# Altium project Inverter.PrjPcb (part 1 of 2)
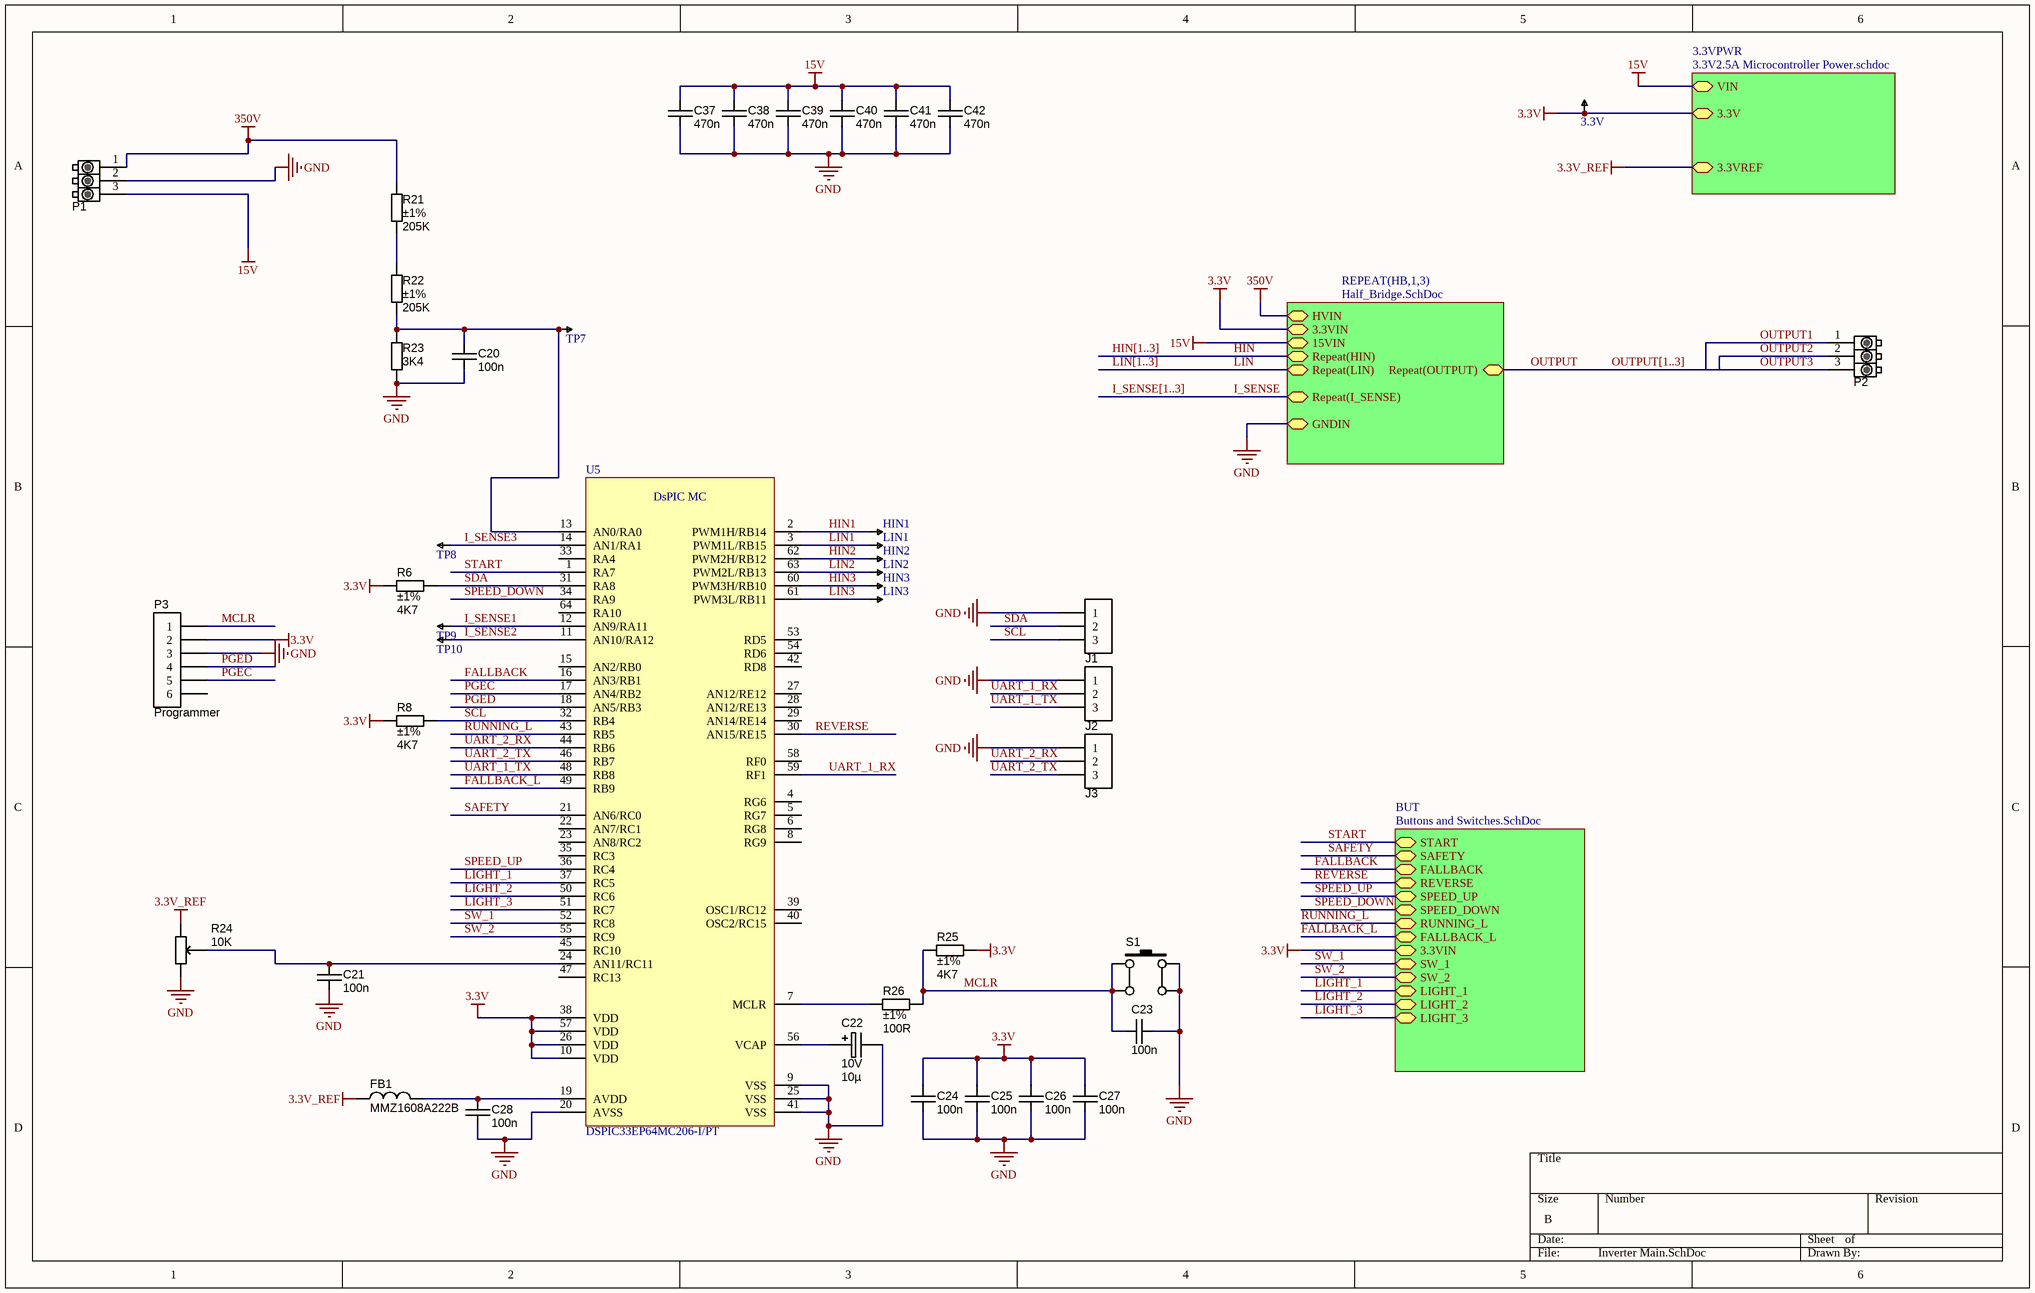
[diagram p0: Inverter Main.SchDoc]
5 sheets, 218 parts. Net scope: hierarchical (ports join the sheet entries above them; power ports are global).
Board file: InverterPCB.PcbDoc
Sheets:
  Inverter Main.SchDoc
    HB1 = Half_Bridge.SchDoc
    HB2 = Half_Bridge.SchDoc
    HB3 = Half_Bridge.SchDoc
    3.3VPWR = 3.3V2.5A Microcontroller Power.schdoc
    BUT = Buttons and Switches.SchDoc
      B1 = Button.SchDoc
      B2 = Button.SchDoc
      B3 = Button.SchDoc
      B4 = Button.SchDoc
      B5 = Button.SchDoc
      B6 = Button.SchDoc
      B7 = Button.SchDoc
      B8 = Button.SchDoc

## Sheet Inverter Main.SchDoc
size B

### Parts
3.3V  TESTPOINT SMD 1206  [1206 Test Point]  (value not drawn)
C20  value 100n  [CAPC1608X90N]  (hidden comment: approved sub OK)
C21  value 100n  [CAPC1608X90N]  (hidden comment: approved sub OK)
C22  Ratings: 10V  [CAPMP2012X150USR]  (hidden comment: 10µ)
C23  value 100n  [CAPC1608X90N]  (hidden comment: approved sub OK)
C24  value 100n  [CAPC1608X90N]  (hidden comment: approved sub OK)
C25  value 100n  [CAPC1608X90N]  (hidden comment: approved sub OK)
C26  value 100n  [CAPC1608X90N]  (hidden comment: approved sub OK)
C27  value 100n  [CAPC1608X90N]  (hidden comment: approved sub OK)
C28  value 100n  [CAPC1608X90N]  (hidden comment: approved sub OK)
C37  value 470n  [CAPC2012X135N]  (hidden comment: approved sub OK)
C38  value 470n  [CAPC2012X135N]  (hidden comment: approved sub OK)
C39  value 470n  [CAPC2012X135N]  (hidden comment: approved sub OK)
C40  value 470n  [CAPC2012X135N]  (hidden comment: approved sub OK)
C41  value 470n  [CAPC2012X135N]  (hidden comment: approved sub OK)
C42  value 470n  [CAPC2012X135N]  (hidden comment: approved sub OK)
FB1  Manufacturer Part Number 1: MMZ1608A222B  [FBC1608X95N]  (hidden comment: 2K2 @ 100 MHz)
HIN1  TESTPOINT SMD 1206  [1206 Test Point]  (value not drawn)
HIN2  TESTPOINT SMD 1206  [1206 Test Point]  (value not drawn)
HIN3  TESTPOINT SMD 1206  [1206 Test Point]  (value not drawn)
J1  JST_PH_B3B  [JST_PH_3_B3B]  (value not drawn)
J2  JST_PH_B3B  [JST_PH_3_B3B]  (value not drawn)
J3  JST_PH_B3B  [JST_PH_3_B3B]  (value not drawn)
LIN1  TESTPOINT SMD 1206  [1206 Test Point]  (value not drawn)
LIN2  TESTPOINT SMD 1206  [1206 Test Point]  (value not drawn)
LIN3  TESTPOINT SMD 1206  [1206 Test Point]  (value not drawn)
P1  3P_TERM BLOCK 796739-3  [TE 796739-3 3 Screw Terminal]  (value not drawn)
P2  3P_TERM BLOCK 796739-3  [TE 796739-3 3 Screw Terminal]  (value not drawn)
P3  Programmer  [HDR1X6]  (no BOM)
R6  value 4K7  Tolerance: ±1%  [RESC1608X55N]  (hidden comment: Thick Film)
R8  value 4K7  Tolerance: ±1%  [RESC1608X55N]  (hidden comment: Thick Film)
R21  value 205K  Tolerance: ±1%  [RESC2012X70N]  (hidden comment: Thick Film)
R22  value 205K  Tolerance: ±1%  [RESC2012X70N]  (hidden comment: Thick Film)
R23  value 3K4  [RESC1608X55N]  (hidden comment: Thick Film)
R24  value 10K  [POT_PDB12_BOURNS]  (hidden comment: RES_POT_10K_THT_PDB12-H4251-103BF)
R25  value 4K7  Tolerance: ±1%  [RESC1608X55N]  (hidden comment: Thick Film)
R26  value 100R  Tolerance: ±1%  [RESC1608X55N]  (hidden comment: Thick Film)
S1  TL3301AF160QJ  [SWITCH_TACT_JLEAD_6mm]  (value not drawn)
TP7  TESTPOINT SMD 1206  [1206 Test Point]  (value not drawn)
TP8  TESTPOINT SMD 1206  [1206 Test Point]  (value not drawn)
TP9  TESTPOINT SMD 1206  [1206 Test Point]  (value not drawn)
TP10  TESTPOINT SMD 1206  [1206 Test Point]  (value not drawn)
U5  uC_dsPIC33EP64MC206  [LQFP50P1200X1200X160-64]  (value not drawn)

### Sub-sheets
3.3VPWR = 3.3V2.5A Microcontroller Power.schdoc: VIN, 3.3V, 3.3VREF
BUT = Buttons and Switches.SchDoc: START, SAFETY, FALLBACK, REVERSE, SPEED_DOWN, SPEED_UP, RUNNING_L, FALLBACK_L, 3.3VIN, SW_1, LIGHT_2, LIGHT_1, SW_2, LIGHT_3
REPEAT(HB,1,3) = Half_Bridge.SchDoc: HVIN, 15VIN, GNDIN, Repeat(LIN), Repeat(HIN), Repeat(OUTPUT), 3.3VIN, Repeat(I_SENSE)

### Nets
3.3V: 3.3V.1 C24.1 C25.1 C26.1 C27.1 P3.2 R6.1 R8.1 R25.2 U5.10(VDD) U5.26(VDD) U5.38(VDD) U5.57(VDD) ; sheet REPEAT(HB,1,3)/3.3VIN, sheet 3.3VPWR/3.3V, sheet BUT/3.3VIN
3.3V_REF: FB1.1 R24.1 ; sheet 3.3VPWR/3.3VREF
15V: C37.1 C38.1 C39.1 C40.1 C41.1 C42.1 P1.3 ; sheet REPEAT(HB,1,3)/15VIN, sheet 3.3VPWR/VIN
350V: P1.1 R21.1 ; sheet REPEAT(HB,1,3)/HVIN
GND: C20.2 C21.2 C22.2 C23.2 C24.2 C25.2 C26.2 C27.2 C28.2 C37.2 C38.2 C39.2 C40.2 C41.2 C42.2 J1.1 J2.1 J3.1 P1.2 P3.3 R23.2 R24.3 S1.3 S1.4 U5.9(VSS) U5.20(AVSS) U5.25(VSS) U5.41(VSS) ; sheet REPEAT(HB,1,3)/GNDIN
FALLBACK: U5.16(AN3/RB1) ; sheet BUT/FALLBACK  [project net BUT2]
FALLBACK_L: U5.49(RB9) ; sheet BUT/FALLBACK_L
HIN: sheet REPEAT(HB,1,3)/Repeat(HIN)
HIN1: HIN1.1 U5.2(PWM1H/RB14)  [project net HIN]
HIN2: HIN2.1 U5.62(PWM2H/RB12)  [project net HIN]
HIN3: HIN3.1 U5.60(PWM3H/RB10)  [project net HIN]
I_SENSE: sheet REPEAT(HB,1,3)/Repeat(I_SENSE)
I_SENSE1: TP9.1 U5.12(AN9/RA11)
I_SENSE2: TP10.1 U5.11(AN10/RA12)
I_SENSE3: TP8.1 U5.14(AN1/RA1)
LIGHT_1: U5.37(RC5) ; sheet BUT/LIGHT_1
LIGHT_2: U5.50(RC6) ; sheet BUT/LIGHT_2
LIGHT_3: U5.51(RC7) ; sheet BUT/LIGHT_3
LIN: sheet REPEAT(HB,1,3)/Repeat(LIN)
LIN1: LIN1.1 U5.3(PWM1L/RB15)  [project net LIN]
LIN2: LIN2.1 U5.63(PWM2L/RB13)  [project net LIN]
LIN3: LIN3.1 U5.61(PWM3L/RB11)  [project net LIN]
MCLR: C23.1 P3.1 R25.1 R26.2 S1.1 S1.2
OUTPUT: sheet REPEAT(HB,1,3)/Repeat(OUTPUT)
OUTPUT1: P2.1
OUTPUT2: P2.2
OUTPUT3: P2.3
PGEC: P3.5 U5.17(AN4/RB2)
PGED: P3.4 U5.18(AN5/RB3)
REVERSE: U5.30(AN15/RE15) ; sheet BUT/REVERSE  [project net BUT4]
RUNNING_L: U5.43(RB5) ; sheet BUT/RUNNING_L
SAFETY: U5.21(AN6/RC0) ; sheet BUT/SAFETY  [project net BUT3]
SCL: J1.3 R8.2 U5.32(RB4)
SDA: J1.2 R6.2 U5.31(RA8)
SPEED_DOWN: U5.34(RA9) ; sheet BUT/SPEED_DOWN  [project net BUT6]
SPEED_UP: U5.36(RC4) ; sheet BUT/SPEED_UP  [project net BUT5]
START: U5.1(RA7) ; sheet BUT/START  [project net BUT1]
SW_1: U5.52(RC8) ; sheet BUT/SW_1  [project net BUT7]
SW_2: U5.55(RC9) ; sheet BUT/SW_2  [project net BUT8]
UART_1_RX: J2.2 U5.59(RF1)
UART_1_TX: J2.3 U5.48(RB8)
UART_2_RX: J3.2 U5.44(RB6)
UART_2_TX: J3.3 U5.46(RB7)
NetC20_1: C20.1 R22.2 R23.1 TP7.1 U5.13(AN0/RA0)
NetC21_1: C21.1 R24.2 U5.24(AN11/RC11)
NetC22_1: C22.1 U5.56(VCAP)
NetC28_1: C28.1 FB1.2 U5.19(AVDD)
NetR21_2: R21.2 R22.1
NetR26_1: R26.1 U5.7(MCLR)

Not connected (* = marked no-connect by the designer): P3 6; U5 4(RG6) 5(RG7) 6(RG8) 8(RG9) 15(AN2/RB0) 22(AN7/RC1) 23(AN8/RC2) 27(AN12/RE12) 28(AN12/RE13) 29(AN14/RE14) 33(RA4) 35(RC3) 39(OSC1/RC12) 40(OSC2/RC15) 42(RD8) 45(RC10) 47(RC13) 53(RD5) 54(RD6) 58(RF0) 64(RA10)

### Buses and harness runs
bus HIN[1..3]
bus I_SENSE[1..3]
bus LIN[1..3]
bus OUTPUT[1..3]

### Notes on the sheet
- (in symbol uC_dsPIC33EP64MC206) DsPIC MC

### Library data of the parts
3.3V HIN1-HIN3 LIN1-LIN3 TP7-TP10 = TESTPOINT SMD 1206: Manufacturer: TE Connectivity AMP Connectors; Manufacturer Part Number: RCS-0C; Material - Insulation: No Insulation; Supplier 1: Digi-Key; Supplier Part Number 1: A106143CT-ND; RoHS: RoHS Compliant; Category: Test and Measurement; Stock 1: 28093; Pricing 1: 1=0.28, 10=0.261, 25=0.224, 50=0.1902, 100=0.1828, 250=0.16412, 500=0.15668, 1000=0.13056 (USD); Packaging: Cut Tape (CT); Part Status: Active; Type: PC Test Point; Mounting Type: Surface Mount; Color: Natural; Size / Dimension: 0.126" L x 0.063" W (3.20mm x 1.60mm); Height: 0.049" (1.25mm); Plating: -; Material - Body: -; ComponentLink1URL: http://www.te.com/commerce/DocumentDelivery/DDEController?Action=srchrtrv&DocNm=1773266&DocType=DS&DocLang=English; ComponentLink1Description: http://www.te.com/commerce/DocumentDelivery/DDEController?Action=srchrtrv&DocNm=1773266&DocType=DS&DocLang=English
C20 C21 C23-C28 = CAPC_100n_0603_X7R_50V_10%: Capacitor SMD Cer 100nF 10% 50V X7R 0603; Manufacturer: Murata Electronics North America; Manufacturer Part Number: GRM188R71H104KA93D; Tolerance: ±10%; Supplier 1: Digi-Key; Supplier Part Number 1: 490-1519-1-ND; RoHS: RoHS Compliant; Category: Capacitors; Stock 1: 21293840; Pricing 1: 1=0.12, 10=0.084, 100=0.0396, 500=0.02778, 1000=0.023 (USD); Packaging: Cut Tape (CT); Part Status: Active; Voltage - Rated: 50V; Temperature Coefficient: X7R; Operating Temperature: -55°C ~ 125°C; Features: -; Ratings: -; Applications: General Purpose; Mounting Type: Surface Mount, MLCC; Package / Case: 0603 (1608 Metric); Size / Dimension: 0.063" L x 0.031" W (1.60mm x 0.80mm); Height - Seated (Max): -; Thickness (Max): 0.035" (0.90mm); Lead Spacing: -; Lead Style: -; ComponentLink1URL: http://www.murata.com/~/media/webrenewal/support/library/catalog/products/capacitor/mlcc/c02e.pdf; ComponentLink1Description: http://www.murata.com/~/media/webrenewal/support/library/catalog/products/capacitor/mlcc/c02e.pdf
C22 = CAPT_10u_0805_10V: Capacitor SMD Tantalum 10uF 20% 10V 0805; Manufacturer 1: AVX Corporation; Manufacturer Part Number 1: TAJP106M010RNJ; SCDType: spec; Package / Case: 0805 (2012 metric); Tolerance: ±20%; Material: Tantalum; Supplier 1: Digi-Key; Supplier Part Number 1: 478-3281-1-ND; Value: 10µ
C37-C42 = CAPC_470n_0805_X7R_50V_10%: 0.47µF ±10% 50V Ceramic Capacitor X7R 0805 (2012 Metric); Manufacturer: Murata Electronics North America; Manufacturer Part Number: GRM21BR71H474KA88K; Supplier 1: Digi-Key; Supplier Part Number 1: 490-8319-1-ND; RoHS: RoHS Compliant; Category: Capacitors; Stock 1: 76560; Pricing 1: 1=0.35, 10=0.244, 100=0.1465, 500=0.10986, 1000=0.09278, 2500=0.08789, 5000=0.08301 (USD); Packaging: Cut Tape (CT); Part Status: Active; Tolerance: ±10%; Voltage - Rated: 50V; Temperature Coefficient: X7R; Operating Temperature: -55°C ~ 125°C; Features: -; Ratings: -; Applications: General Purpose; Mounting Type: Surface Mount, MLCC; Package / Case: 0805 (2012 Metric); Size / Dimension: 0.079" L x 0.049" W (2.00mm x 1.25mm); Height - Seated (Max): -; Thickness (Max): 0.053" (1.35mm); Lead Spacing: -; Lead Style: -; ComponentLink1URL: http://search.murata.co.jp/Ceramy/image/img/A01X/G101/ENG/GRM21BR71H474KA88-01.pdf; ComponentLink1Description: http://search.murata.co.jp/Ceramy/image/img/A01X/G101/ENG/GRM21BR71H474KA88-01.pdf
FB1 = FERRITE_2K2-100MHz_0603: Ferrite bead 2.2K Ohm at 100 MHz 200mA 0603 SMD; Manufacturer 1: TDK Corporation; Ratings: 200 mA; 800 mOhm DC; Impedance @ Frequency: 2200 Ohm @ 100MHz; DC Resistance (DCR): 800 mOhm Max; Filter Type: Differential Mode - Single; SCDType: source; Size / Dimension: 0.063" L x 0.031" W (1.60mm x 0.80mm); Current Rating: 200mA; Package / Case: 0603 (1608 Metric); Height (Max): 0.037" (0.95mm); Mounting Type: Surface Mount; Supplier 1: Digi-Key; Supplier Part Number 1: 445-8671-1-ND; RoHS 1: RoHS Compliant; ComponentLink1URL: http://www.tdk.co.jp/tefe02/e9412_mmz.pdf; ComponentLink1Description: http://www.tdk.co.jp/tefe02/e9412_mmz.pdf; Value: 2K2 @ 100 MHz
J1-J3 = JST_PH_B3B: 2mm Pitch; Supplier 1: Digi-Key; Supplier Part Number 1: 455-1705-ND
P1 P2 = 3P_TERM BLOCK 796739-3: 3 Position Wire to Board Terminal Block Horizontal with Board 0.375" (9.53mm) Through Hole; Manufacturer: TE Connectivity AMP Connectors; Number of Levels: 1; Positions Per Level: 3; Current: 30A; Voltage: 600V; Wire Gauge: 10-30 AWG; Wire Termination: Screw - Rising Cage Clamp; Clamp Material - Plating: Brass - Nickel Plated; Torque - Screw: 0.79 Nm (7.0 Lb-In); Screw Thread: M3; Supplier 1: Digi-Key; Supplier Part Number 1: A98274-ND; RoHS: RoHS Compliant; Category: Connectors, Interconnects; Stock 1: 1080; Pricing 1: 1=5.17, 10=3.942, 25=3.692, 50=3.2816, 100=3.2104, 250=2.96064, 500=2.6753, 1000=2.37209, 2500=2.274 (USD); Packaging: Tray; Part Status: Active; Pitch: 0.375" (9.53mm); Mating Orientation: Horizontal with Board; Mounting Type: Through Hole; Features: Interlocking (Side); Color: Green; Operating Temperature: -; Housing Material: Polyamide (PA66), Nylon 6/6; Contact Material - Plating: -; Screw Material - Plating: Brass - Nickel Plated; ComponentLink1URL: http://www.te.com/commerce/DocumentDelivery/DDEController?Action=srchrtrv&DocNm=796739&DocType=Customer+Drawing&DocLang=English; ComponentLink1Description: http://www.te.com/commerce/DocumentDelivery/DDEController?Action=srchrtrv&DocNm=796739&DocType=Customer+Drawing&DocLang=English; Manufacturer Part Number: 796739-3
P3 = Header6P: Header, 6-pin
R6 R8 R25 = RES_4K7_0603_1%: Resistor SMD chip 4.7K Ohm 0.1W 1% 0603; Manufacturer: Yageo; Manufacturer Part Number: RC0603FR-074K7L; Ratings: 1/10W; SCDType: undef; Package / Case: 0603 (1608 Metric); Supplier 1: Digi-Key; Supplier Part Number 1: 311-4.70KHRCT-ND
R21 R22 = RES_205K_0805_1%: Resistor SMD chip 205k Ohm 0.125W 1% 0805; Manufacturer 1: Vishay/Dale; Manufacturer Part Number 1: CRCW0805205KFKEA; Ratings: 1/8W; SCDType: spec; Package / Case: 0805 (2012 metric); Supplier 1: Digi-Key; Supplier Part Number 1: 541-205KCCT-ND
R23 = RES_3K4_0603_1%: Resistor SMD chip 3.4k Ohm 0.1W 1% 0603; Manufacturer: Panasonic Electronic Components; Manufacturer Part Number: ERJ-3EKF3401V; Power (Watts): 0.1W, 1/10W; Temperature Coefficient: ±100ppm/°C; Tolerance: ±1%; Supplier 1: Digi-Key; Supplier Part Number 1: P3.40KHCT-ND; RoHS: RoHS Compliant; Category: Resistors; Stock 1: 108430; Pricing 1: 1=0.1, 10=0.021, 100=0.0087, 1000=0.00389, 2500=0.00338 (USD); Packaging: Cut Tape (CT); Part Status: Active; Composition: Thick Film; Features: Automotive AEC-Q200; Operating Temperature: -55°C ~ 155°C; Package / Case: 0603 (1608 Metric); Supplier Device Package: 0603; Size / Dimension: 0.063" L x 0.031" W (1.60mm x 0.80mm); Height - Seated (Max): 0.022" (0.55mm); Failure Rate: -; ComponentLink1URL: https://industrial.panasonic.com/cdbs/www-data/pdf/RDA0000/AOA0000C304.pdf; ComponentLink1Description: https://industrial.panasonic.com/cdbs/www-data/pdf/RDA0000/AOA0000C304.pdf
R24 = RES_POT_10K_THT_PDB12-H4251-103BF: 10k Ohm 1 Gang Linear Through Hole Potentiometer None 1 Turn Carbon 0.08W PC Pins, Board Locks; Manufacturer: Bourns Inc.; Tolerance: ±20%; Rotation: 300°; Adjustment Type: Top Adjustment; Actuator Type: Flatted; Actuator Length: 0.984" (25.00mm); Actuator Diameter: 0.236" (6.00mm); Supplier 1: Digi-Key; Supplier Part Number 1: PDB12-H4251-103BF-ND; RoHS: RoHS Compliant; Category: Potentiometers, Variable Resistors; Stock 1: 946; Pricing 1: 1=0.92, 10=0.81, 25=0.7292, 50=0.702, 100=0.675, 250=0.63452, 500=0.54, 1000=0.4995, 5000=0.4104 (USD); Packaging: Bulk; Part Status: Active; Taper: Linear; Resistance (Ohms): 10k; Built in Switch: None; Power (Watts): 0.08W; Temperature Coefficient: -; Resistive Material: Carbon; Termination Style: PC Pins, Board Locks; Bushing Thread: -; Mounting Type: Through Hole; ComponentLink1URL: http://www.bourns.com/docs/Product-Datasheets/PDB12.pdf; ComponentLink1Description: http://www.bourns.com/docs/Product-Datasheets/PDB12.pdf; Manufacturer Part Number: PDB12-H4251-103BF
R26 = RES_100R_0603_1%: Resistor SMD chip 100 Ohm 0.1W 1% 0603; Manufacturer 1: Yageo; Manufacturer Part Number 1: RC0603FR-07100RL; Ratings: 1/10 W; SCDType: spec; Package / Case: 0603 (1608 Metric); Material: Thick Film; Supplier 1: Digi-Key; Supplier Part Number 1: 311-100HRCT-ND; Supplier 2: Digi-Key; Supplier Part Number 2: P100HTR-ND; Manufacturer 2: Panasonic - ECG; Manufacturer Part Number 2: ERJ-3EKF1000V; ComponentLink1URL: http://industrial.panasonic.com/www-cgi/jvcr13pz.cgi?E+PZ+3+AOA0002+ERJ3EKF1000V+7+WW; ComponentLink1Description: http://industrial.panasonic.com/www-cgi/jvcr13pz.cgi?E+PZ+3+AOA0002+ERJ3EKF1000V+7+WW
S1 = TACT_SWITCH 6x6 JLEAD TL3301AF160QJ: Manufacturer: E-Switch; Circuit: SPST-NO; Switch Function: Off-Mom; Contact Rating @ Voltage: 0.05A @ 12VDC; Actuator Type: Standard; Actuator Height off PCB, Vertical: 5.00mm; Actuator Orientation: Top Actuated; Outline: 6.00mm x 6.00mm; Illumination: Non-Illuminated; Operating Force: 160gf; Actuator Material: Polyamide (PA), Nylon; Switch Travel: 0.25mm; Mechanical Life: 100,000 Cycles; Supplier 1: Digi-Key; Supplier Part Number 1: EG4374CT-ND; RoHS: RoHS Compliant; Category: Switches; Stock 1: 12724; Pricing 1: 1=0.43, 10=0.41, 25=0.4024, 50=0.387, 100=0.334, 250=0.3036, 500=0.28842 (USD); Packaging: Cut Tape (CT); Part Status: Active; Mounting Type: Surface Mount; Actuator Length, Right Angle: -; Termination Style: J Lead; Illumination Type, Color: -; Illumination Voltage (Nominal): -; Ingress Protection: -; Features: -; Operating Temperature: -20°C ~ 70°C; ComponentLink1URL: https://www.e-switch.com/system/asset/product_line/data_sheet/158/TL3301.pdf; ComponentLink1Description: https://www.e-switch.com/system/asset/product_line/data_sheet/158/TL3301.pdf; Manufacturer Part Number: TL3301AF160QJ
U5 = uC_dsPIC33EP64MC206: DSPIC33EP64MC206-I/PT; Manufacturer: Microchip Technology; Core Processor: dsPIC; Core Size: 16-Bit; Speed: 70 MIPs; Connectivity: I²C, IrDA, LIN, QEI, SPI, UART/USART; Peripherals: Brown-out Detect/Reset, DMA, Motor Control PWM, POR, PWM, WDT; Program Memory Size: 64KB (22K x 24); Program Memory Type: FLASH; RAM Size: 4K x 16; Voltage - Supply (Vcc/Vdd): 3 V ~ 3.6 V; Data Converters: A/D 16x10b/12b; Oscillator Type: Internal; Supplier 1: Digi-Key; Supplier Part Number 1: DSPIC33EP64MC206-I/PT-ND; RoHS: RoHS Compliant; Category: Integrated Circuits (ICs); Stock 1: 6; Pricing 1: 1=3.03, 25=2.7824, 100=2.52 (USD); Packaging: Tray; Part Status: Active; EEPROM Size: -; Operating Temperature: -40°C ~ 85°C (TA); Package / Case: 64-TQFP; Supplier Device Package: 64-TQFP (10x10); ComponentLink1URL: http://www.microchip.com/mymicrochip/filehandler.aspx?ddocname=en556386; ComponentLink1Description: http://www.microchip.com/mymicrochip/filehandler.aspx?ddocname=en556386; Manufacturer Part Number: DSPIC33EP64MC206-I/PT

## Sheet Half_Bridge.SchDoc
size A
Used 3 times, as channels HB1, HB2, HB3. Parts and nets are listed once, with the designators drawn on the sheet.
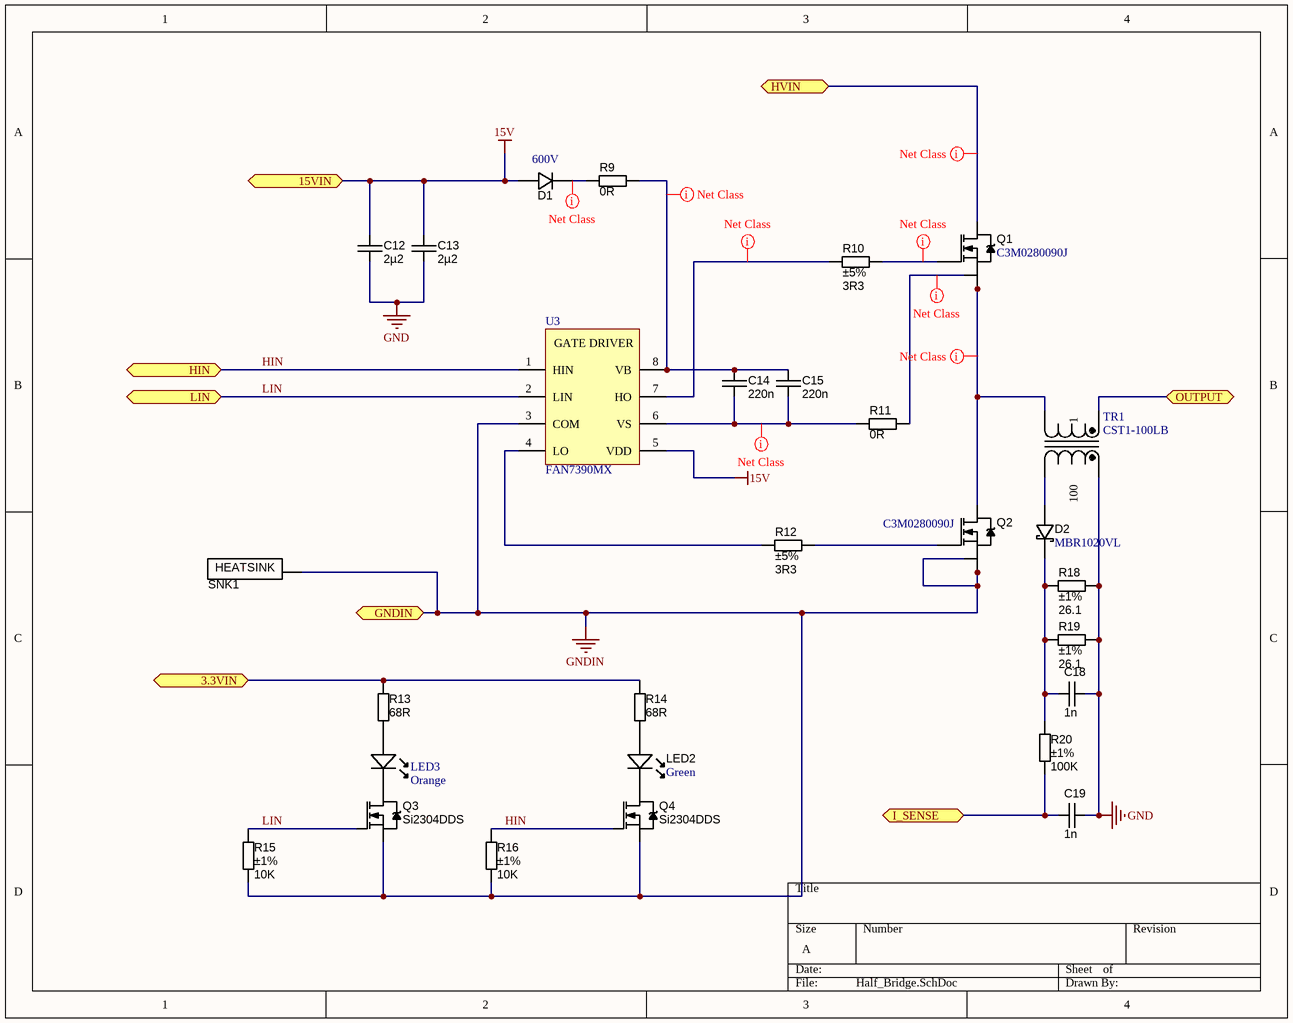
[diagram p1: Half_Bridge.SchDoc]

### Parts
C12  value 2µ2  [CAPC3216X180N]  (hidden comment: approved sub OK)
C13  value 2µ2  [CAPC3216X180N]  (hidden comment: approved sub OK)
C14  value 220n  [CAPC1632X07N]  (hidden comment: approved sub OK)
C15  value 220n  [CAPC1632X07N]  (hidden comment: approved sub OK)
C18  value 1n  [CAPC1608X90N]  (hidden comment: approved sub OK)
C19  value 1n  [CAPC1608X90N]  (hidden comment: approved sub OK)
D1  Voltage - DC Reverse (Vr) (Max): 600V  [DO-214AA]  (hidden comment: ER2J-LTP)
D2  Manufacturer Part Number: MBR1020VL  [SOD123F]  (hidden comment: B320A-13-F)
LED2  Color: Green  [LED-0603-GREEN]  (hidden comment: APT1608CGCK)
LED3  Color: Orange  [LED-0603-AMBER]  (hidden comment: LO L296-Q2S1-24-Z)
Q1  Manufacturer Part Number: C3M0280090J  [DPAK127P1618X457-8N]  (hidden comment: C3M0065090D)
Q2  Manufacturer Part Number: C3M0280090J  [DPAK127P1618X457-8N]  (hidden comment: C3M0065090D)
Q3  Si2304DDS  [SOT23-3]
Q4  Si2304DDS  [SOT23-3]
R9  value 0R  [RESC2012X70N]  (hidden comment: Jumper)
R10  value 3R3  Tolerance: ±5%  [RESC2012X70N]  (hidden comment: Thick Film)
R11  value 0R  [RESC2012X70N]  (hidden comment: Jumper)
R12  value 3R3  Tolerance: ±5%  [RESC2012X70N]  (hidden comment: Thick Film)
R13  value 68R  [RESC1608X55N]  (hidden comment: Thick Film)
R14  value 68R  [RESC1608X55N]  (hidden comment: Thick Film)
R15  value 10K  Tolerance: ±1%  [RESC1005X40N]  (hidden comment: Thick Film)
R16  value 10K  Tolerance: ±1%  [RESC1005X40N]  (hidden comment: Thick Film)
R18  value 26.1  Tolerance: ±1%  [RESC2012X70N]  (hidden comment: Thick Film)
R19  value 26.1  Tolerance: ±1%  [RESC2012X70N]  (hidden comment: Thick Film)
R20  value 100K  Tolerance: ±1%  [RESC1608X55N]  (hidden comment: Thick Film)
SNK1  ATS-CPX025025010-137-C2-R0  [HeatSink ATS-CPX025025010-165-C2-R0]  (value not drawn)
TR1  CST1-100LB  [CST1]
U3  FAN7390MX  [SOIC127P600X175-8AN]

### Ports
3.3VIN, 15VIN, GNDIN, HIN, HVIN, I_SENSE, LIN, OUTPUT

### Nets
15V: C12.1 C13.1 D1.A U3.5(VDD) ; port 15VIN
GND: C12.2 C13.2 C18.2 C19.2 R18.2 R19.2 TR1.6
GNDIN: Q2.2 Q2.3(S) Q2.4 Q2.5 Q2.6 Q2.7 Q3.2(S) Q4.2(S) R15.2 R16.2 SNK1.1(GND) U3.3(COM) ; port GNDIN
3.3VIN: R13.1 R14.1 ; port 3.3VIN
HIN: Q4.1(G) R16.1 U3.1(HIN) ; port HIN
HVIN: Q1.8(D) ; port HVIN
I_SENSE: C19.1 R20.1 ; port I_SENSE
LIN: Q3.1(G) R15.1 U3.2(LIN) ; port LIN
OUTPUT: TR1.8 ; port OUTPUT
NetC14_1: C14.1 C15.1 R9.2 U3.8(VB)
NetC14_2: C14.2 C15.2 R11.1 U3.6(VS)
NetC18_1: C18.1 D2.K R18.1 R19.1 R20.2
NetD1_K: D1.K R9.1
NetD2_A: D2.A TR1.4
NetLED2_A: LED2.A R14.2
NetLED2_K: LED2.K Q4.3(D)
NetLED3_A: LED3.A R13.2
NetLED3_K: LED3.K Q3.3(D)
NetQ1_1: Q1.1(G) R10.2
NetQ1_2: Q1.2 R11.2
NetQ1_3: Q1.3(S) Q1.4 Q1.5 Q1.6 Q1.7 Q2.8(D) TR1.7
NetQ2_1: Q2.1(G) R12.2
NetR10_1: R10.1 U3.7(HO)
NetR12_1: R12.1 U3.4(LO)

### Channels
HB1: designators C12=C12_HB1 C13=C13_HB1 C14=C14_HB1 C15=C15HB1 C18=C18HB1 C19=C19HB1 D1=D1HB1 D2=D2HB1 LED2=LED2_HB1 LED3=LED3_HB1 Q1=Q1_HB1 Q2=Q2_HB1 Q3=Q3_HB1 Q4=Q4_HB1 R9=R9_HB1 R10=R10_HB1 R11=R11_HB1 R12=R12_HB1 R13=R13_HB1 R14=R14_HB1 R15=R15_HB1 R16=R16_HB1 R18=R18HB1 R19=R19HB1 R20=R20HB1 SNK1=SNK1HB1 TR1=TR1HB1 U3=U3_HB1; ports 3.3VIN=3.3V 15VIN=15V GNDIN=GND HIN=HIN HVIN=350V I_SENSE=I_SENSE1 LIN=LIN OUTPUT=OUTPUT1
HB2: designators C12=C12_HB2 C13=C13_HB2 C14=C14_HB2 C15=C15HB2 C18=C18HB2 C19=C19HB2 D1=D1HB2 D2=D2HB2 LED2=LED2_HB2 LED3=LED3_HB2 Q1=Q1_HB2 Q2=Q2_HB2 Q3=Q3_HB2 Q4=Q4_HB2 R9=R9_HB2 R10=R10_HB2 R11=R11_HB2 R12=R12_HB2 R13=R13_HB2 R14=R14_HB2 R15=R15_HB2 R16=R16_HB2 R18=R18HB2 R19=R19HB2 R20=R20HB2 SNK1=SNK1HB2 TR1=TR1HB2 U3=U3_HB2; ports 3.3VIN=3.3V 15VIN=15V GNDIN=GND HIN=HIN HVIN=350V I_SENSE=I_SENSE2 LIN=LIN OUTPUT=OUTPUT2
HB3: designators C12=C12_HB3 C13=C13_HB3 C14=C14_HB3 C15=C15HB3 C18=C18HB3 C19=C19HB3 D1=D1HB3 D2=D2HB3 LED2=LED2_HB3 LED3=LED3_HB3 Q1=Q1_HB3 Q2=Q2_HB3 Q3=Q3_HB3 Q4=Q4_HB3 R9=R9_HB3 R10=R10_HB3 R11=R11_HB3 R12=R12_HB3 R13=R13_HB3 R14=R14_HB3 R15=R15_HB3 R16=R16_HB3 R18=R18HB3 R19=R19HB3 R20=R20HB3 SNK1=SNK1HB3 TR1=TR1HB3 U3=U3_HB3; ports 3.3VIN=3.3V 15VIN=15V GNDIN=GND HIN=HIN HVIN=350V I_SENSE=I_SENSE3 LIN=LIN OUTPUT=OUTPUT3

### Layout directives
net class BOOT_S: NetC14_HB1_1, NetC14_HB1_2, NetD1HB1_K, NetQ1_HB1_1, NetQ1_HB1_2, NetQ1_HB1_3, NetR10_HB1_1
net class 350V: 350V

### Notes on the sheet
- (in symbol CURRENT_100:1_20A_CST1-100LB) 1; 100
- (in symbol GATE_DRV_2_600V_4.5A) GATE DRIVER
- (in symbol HEATSINK_25mmx25mm_ATS-CPX025025010-137-C2-R0) HEATSINK

### Library data of the parts
C12 C13 = CAPC_2u2_50V_1206: Capacitor SMD Cer 2.2uF 10% 50V X7R 1206; SCDType: undef; Tolerance: ±10%; Supplier 1: Digi-Key; Supplier Part Number 1: 1276-1291-1-ND
C14 C15 = CAPC_220n_0612_X7R_25V_10%: Capacitor SMD Cer 220nF 10% 25V X7R 0612; Manufacturer: AVX Corporation; Manufacturer Part Number: 06123C224KAT2A; Tolerance: ±20%; Voltage - Rated: 25V; Supplier 1: Digi-Key; Supplier Part Number 1: 478-2902-1-ND; RoHS: RoHS Compliant; Category: Capacitors; Stock 1: 3680; Pricing 1: 1=1.73, 10=1.366, 100=1.0247, 500=0.77418, 1000=0.6831 (USD); Packaging: Cut Tape (CT); Part Status: Active; Temperature Coefficient: X7R; Operating Temperature: -55°C ~ 125°C; Features: Low ESL (Reverse Geometry); Ratings: -; Applications: Bypass, Decoupling; Mounting Type: Surface Mount, MLCC; Package / Case: 0612 (1632 Metric); Size / Dimension: 0.063" L x 0.126" W (1.60mm x 3.20mm); Height - Seated (Max): -; Thickness (Max): 0.050" (1.27mm); Lead Spacing: -; Lead Style: -; ComponentLink1URL: http://datasheets.avx.com/licc.pdf; ComponentLink1Description: http://datasheets.avx.com/licc.pdf
C18 C19 = CAPC_1n_0603_X7R_100V_10%: Capacitor SMD Cer 1nF 10% 100V X7R 0603; Manufacturer 1: Murata Electronics North America; Manufacturer Part Number 1: GCM188R72A102KA37D; Ratings: 100V; X7R; Material: ceramic; SCDType: spec; Package / Case: 0603 (1608 metric); Tolerance: ±10%; Supplier 1: Digi-Key; Supplier Part Number 1: 490-4780-1-ND; Operating Temperature: -55°C ~ 125°C; Size / Dimension: 0.063" L x 0.031" W (1.60mm x 0.80mm); Thickness (Max): 0.035" (0.90mm); ComponentLink1URL: http://search.murata.co.jp/Ceramy/image/img/PDF/ENG/GCM188R72A102KA37.pdf; ComponentLink1Description: http://search.murata.co.jp/Ceramy/image/img/PDF/ENG/GCM188R72A102KA37.pdf
D1 = DIODE_600V_2A_ER2J-LTP: Diode Standard 600V 2A Surface Mount DO-214AA (SMB); Manufacturer: Micro Commercial Co; Voltage - Forward (Vf) (Max) @ If: 1.7V @ 2A; Speed: Fast Recovery =< 500ns, > 200mA (Io); Current - Reverse Leakage @ Vr: 5µA @ 600V; Capacitance @ Vr, F: 15pF @ 4V, 1MHz; Supplier 1: Digi-Key; Supplier Part Number 1: ER2J-LTPMSCT-ND; RoHS: RoHS Compliant; Category: Discrete Semiconductor Products; Stock 1: 527; Pricing 1: 1=0.51, 10=0.362, 25=0.2976, 100=0.2379, 250=0.17304, 500=0.1406, 1000=0.10815 (USD); Packaging: Cut Tape (CT); Part Status: Active; Diode Type: Standard; Current - Average Rectified (Io): 2A; Mounting Type: Surface Mount; Package / Case: DO-214AA, SMB; Supplier Device Package: DO-214AA (SMB); Operating Temperature - Junction: -65°C ~ 175°C; ComponentLink1URL: http://www.mccsemi.com/up_pdf/ER2A-L~ER2J-L(DO-214AA).pdf; ComponentLink1Description: http://www.mccsemi.com/up_pdf/ER2A-L~ER2J-L(DO-214AA).pdf; Manufacturer Part Number: ER2J-LTP
D2 = DIODE_SCHOTTKY_20V_1A_MBR1020VL: Diode Schottky 20V 1A Surface Mount SOD-123F; Manufacturer: Fairchild/ON Semiconductor; Voltage - Forward (Vf) (Max) @ If: 340mV @ 1A; Speed: Fast Recovery =< 500ns, > 200mA (Io); Current - Reverse Leakage @ Vr: 600µA @ 20V; Supplier 1: Digi-Key; Supplier Part Number 1: MBR1020VLCT-ND; RoHS: RoHS Compliant; Category: Discrete Semiconductor Products; Stock 1: 10857; Pricing 1: 1=0.39, 10=0.293, 100=0.1661, 500=0.11, 1000=0.08433 (USD); Packaging: Cut Tape (CT); Part Status: Active; Diode Type: Schottky; Current - Average Rectified (Io): 1A; Capacitance @ Vr, F: -; Mounting Type: Surface Mount; Package / Case: SOD-123F; Supplier Device Package: SOD-123F; Operating Temperature - Junction: -55°C ~ 125°C; ComponentLink1URL: https://www.fairchildsemi.com/datasheets/MB/MBR1020VL.pdf; ComponentLink1Description: https://www.fairchildsemi.com/datasheets/MB/MBR1020VL.pdf
LED2 = LED_SMD_Green_0603_50mcd: Green 570nm LED Indication - Discrete 2.1V 0603 (1608 Metric); Manufacturer: Kingbright; Lens Color: Colorless; Lens Transparency: Clear; Millicandela Rating: 50mcd; Lens Style/Size: Rectangle with Flat Top, 1.20mm x 0.80mm; Current - Test: 20mA; Viewing Angle: 120°; Wavelength - Peak: 574nm; Supplier 1: Digi-Key; Supplier Part Number 1: 754-1116-1-ND; Manufacturer Part Number: APT1608CGCK; Packaging: Cut Tape (CT); Part Status: Active; Voltage - Forward (Vf) (Typ): 2.1V; Mounting Type: Surface Mount; Wavelength - Dominant: 570nm; Features: -; Package / Case: 0603 (1608 Metric); Supplier Device Package: Chip LED; Size / Dimension: 1.60mm L x 0.80mm W; Height (Max): 0.75mm; ComponentLink1URL: http://www.kingbrightusa.com/images/catalog/SPEC/APT1608CGCK.pdf; ComponentLink1Description: http://www.kingbrightusa.com/images/catalog/SPEC/APT1608CGCK.pdf; RoHS: RoHS Compliant; Category: Optoelectronics; Stock 1: 896844; Pricing 1: 1=0.47, 10=0.337, 25=0.258, 100=0.1683, 250=0.12344, 500=0.10472, 1000=0.08602 (USD)
LED3 = LED_0603_Orange: LED ORANGE DIFFUSED 0603 SMD; Manufacturer: OSRAM Opto Semiconductors Inc.; Lens Color: White; Millicandela Rating: 157mcd; Lens Style/Size: Rectangle with Flat Top, 1.30mm x 0.80mm; Voltage - Forward (Vf) (Typ): 2V; Current - Test: 20mA; Viewing Angle: 160°; Wavelength - Dominant: 605nm; Supplier 1: Digi-Key; Manufacturer Part Number: LO L296-Q2S1-24-Z; Packaging: Cut Tape (CT); Part Status: Active; Lens Transparency: Diffused; Mounting Type: Surface Mount; Wavelength - Peak: -; Features: -; Package / Case: 0603 (1608 Metric); Size / Dimension: 1.70mm L x 0.80mm W; Height (Max): 0.65mm; ComponentLink1URL: http://www.osram-os.com/Graphics/XPic9/00077122_0.pdf; ComponentLink1Description: http://www.osram-os.com/Graphics/XPic9/00077122_0.pdf; Supplier Part Number 1: 475-2739-1-ND; RoHS: RoHS Compliant; Category: Optoelectronics; Stock 1: 4435; Pricing 1: 1=0.34, 10=0.245, 25=0.2004, 100=0.1603, 250=0.13524, 500=0.11522, 1000=0.09017, 2500=0.08349 (USD)
Q1 Q2 = SiC_N-CHAN_900V_11A_C3M0280090J: N-Channel 36A (Tc) 125W (Tc) Through Hole TO-247-3; Manufacturer: Cree/Wolfspeed; Current - Continuous Drain (Id) @ 25°C: 11A (Tc); Drive Voltage (Max Rds On,  Min Rds On): 15V; Vgs(th) (Max) @ Id: 3.5V @ 1.2mA; Gate Charge (Qg) (Max) @ Vgs: 9.5nC @ 15V; Input Capacitance (Ciss) (Max) @ Vds: 150pF @ 600V; Vgs (Max): +18V, -8V; Power Dissipation (Max): 50W (Tc); Rds On (Max) @ Id, Vgs: 360 mOhm @ 7.5A, 15V; Supplier 1: Digi-Key; Supplier Part Number 1: C3M0280090J-ND; RoHS: RoHS Compliant; Category: Discrete Semiconductor Products; Stock 1: 713; Pricing 1: 1=3.84 (USD); Packaging: Tube; Part Status: Active; FET Type: N-Channel; Technology: SiCFET (Silicon Carbide); FET Feature: -; Operating Temperature: -55°C ~ 150°C (TJ); Mounting Type: Surface Mount; Supplier Device Package: D2PAK-7; Package / Case: TO-263-8, D²Pak (7 Leads + Tab), TO-263CA; ComponentLink1URL: http://www.wolfspeed.com/media/downloads/835/C3M0280090J.pdf; ComponentLink1Description: http://www.wolfspeed.com/media/downloads/835/C3M0280090J.pdf
Q3 Q4 = MOSFET_Si2304DDS: MOSFET SMD N-CH 30V 3.6A 1.7W SOT23-3; Material: Metal Oxide; SCDType: source; Ratings: 30V; 3.6A; Package / Case: SOT23-3; Supplier 1: Digi-Key; Supplier Part Number 1: SI2304DDS-T1-GE3CT-ND
R9 R11 = RES_0R_0805: Resistor SMD chip 0.0 Ohm 0.125W 0805; Manufacturer 1: Samsung Electro-Mechanics America, Inc; Manufacturer Part Number 1: RC2012J000CS; Ratings: 1/8W; SCDType: spec; Tolerance: N/A; Package / Case: 0805 (2012 metric); Supplier 1: Digi-Key; Supplier Part Number 1: 1276-5466-6-ND; RoHS 1: RoHS Compliant; ComponentLink1URL: http://www.samsungsem.com/servlet/FileDownload?filename=productcatalog/pdf/Chip_Resistor.pdf; ComponentLink1Description: http://www.samsungsem.com/servlet/FileDownload?filename=productcatalog/pdf/Chip_Resistor.pdf; Supplier 2: Digi-Key; Supplier Part Number 2: RMCF0805ZT0R00DKR-ND; Manufacturer 2: Stackpole Electronics Inc; Manufacturer Part Number 2: RMCF0805ZT0R00; RoHS 2: RoHS Compliant; ComponentLink2URL: http://www.seielect.com/Catalog/SEI-RMCF_RMCP.pdf; ComponentLink2Description: http://www.seielect.com/Catalog/SEI-RMCF_RMCP.pdf; Supplier 3: Digi-Key; Supplier Part Number 3: 311-0.0ARDKR-ND; Manufacturer 3: Yageo; Manufacturer Part Number 3: RC0805JR-070RL; RoHS 3: RoHS Compliant; ComponentLink3URL: http://media.digikey.com/pdf/Data%20Sheets/Yageo%20PDFs/RC0805%20Pb%20Free.pdf; ComponentLink3Description: http://media.digikey.com/pdf/Data%20Sheets/Yageo%20PDFs/RC0805%20Pb%20Free.pdf; Supplier 4: Digi-Key; Supplier Part Number 4: P0.0ADKR-ND; Manufacturer 4: Panasonic Electronic Components; Manufacturer Part Number 4: ERJ-6GEY0R00V; RoHS 4: RoHS Compliant; ComponentLink4URL: http://industrial.panasonic.com/www-cgi/jvcr13pz.cgi?E+PZ+3+AOA0001+ERJ6GEY0R00V+7+WW; ComponentLink4Description: http://industrial.panasonic.com/www-cgi/jvcr13pz.cgi?E+PZ+3+AOA0001+ERJ6GEY0R00V+7+WW; Supplier 5: Digi-Key; Supplier Part Number 5: RHM0.0CPDKR-ND; Manufacturer 5: Rohm Semiconductor; Manufacturer Part Number 5: MCR10ERTJ000; RoHS 5: RoHS Compliant; ComponentLink5URL: http://rohmfs.rohm.com/en/products/databook/datasheet/passive/resistor/chip_resistor/mcr_g.pdf; ComponentLink5Description: http://rohmfs.rohm.com/en/products/databook/datasheet/passive/resistor/chip_resistor/mcr_g.pdf
R10 R12 = RES_3R3_0805_5%: Resistor SMD chip 3.3 Ohm 0.5W 0805; Manufacturer: Panasonic Electronic Components; Manufacturer Part Number: ERJ-6DQJ3R0V; Power (Watts): 0.5W, 1/2W; Temperature Coefficient: ±100ppm/°C; Supplier 1: Digi-Key; Supplier Part Number 1: P19231CT-ND; RoHS: RoHS Compliant; Category: Resistors; Stock 1: 3694; Pricing 1: 1=0.23, 10=0.198, 25=0.1444, 50=0.1046, 100=0.0776, 250=0.05952, 500=0.0469, 1000=0.03247 (USD); Packaging: Cut Tape (CT); Part Status: Active; Composition: Thick Film; Features: Automotive AEC-Q200, Current Sense; Operating Temperature: -55°C ~ 155°C; Package / Case: 0805 (2012 Metric); Supplier Device Package: 0805; Size / Dimension: 0.079" L x 0.049" W (2.00mm x 1.25mm); Height - Seated (Max): 0.028" (0.70mm); Failure Rate: -; ComponentLink1URL: https://industrial.panasonic.com/cdbs/www-data/pdf/RDN0000/AOA0000C313.pdf; ComponentLink1Description: https://industrial.panasonic.com/cdbs/www-data/pdf/RDN0000/AOA0000C313.pdf
R13 R14 = RES_68R_0603_5%: Resistor SMD chip 68 Ohm 0.1W 5% 0603; Manufacturer 1: Yageo; Manufacturer Part Number 1: RC0603JR-0768RL; Ratings: 1/10 W; SCDType: spec; Package / Case: 0603 (1608 metric); Tolerance: ±5%; Material: Thick Film; Supplier 1: Digi-Key; Supplier Part Number 1: 311-68GRCT-ND
R15 R16 = RES_10K_0402_1%: Resistor SMD chip 10k Ohm 0.063W 1% 0402; Manufacturer 1: Vishay Dale; Manufacturer Part Number 1: CRCW040210K0FKED; Ratings: 1/16 W; SCDType: spec; Package / Case: 0402 (1005 Metric); Manufacturer 2: Yageo; Manufacturer Part Number 2: RC0402FR-0710KL; Supplier 1: Digi-Key; Supplier Part Number 1: 541-10.0KLCT-ND; ComponentLink1URL: http://www.vishay.com/doc?20035; ComponentLink1Description: http://www.vishay.com/doc?20035; Supplier 2: Digi-Key; Supplier Part Number 2: 311-10.0KLRCT-ND; ComponentLink2URL: http://www.yageo.com/documents/recent/PYu-RC0402_51_RoHS_L_6.pdf; ComponentLink2Description: http://www.yageo.com/documents/recent/PYu-RC0402_51_RoHS_L_6.pdf
R18 R19 = RES_26R1_0805_1%: Resistor SMD chip 26.1k Ohm 0.125W 1% 0805; Manufacturer: Panasonic Electronic Components; Manufacturer Part Number: ERJ-6ENF26R1V; Power (Watts): 0.125W, 1/8W; Temperature Coefficient: ±100ppm/°C; Supplier 1: Digi-Key; Supplier Part Number 1: P26.1CCT-ND; RoHS: RoHS Compliant; Category: Resistors; Stock 1: 23109; Pricing 1: 1=0.1, 10=0.041, 100=0.0167, 1000=0.00749, 2500=0.0065 (USD); Packaging: Cut Tape (CT); Part Status: Active; Composition: Thick Film; Features: Automotive AEC-Q200; Operating Temperature: -55°C ~ 155°C; Package / Case: 0805 (2012 Metric); Supplier Device Package: 0805; Size / Dimension: 0.079" L x 0.049" W (2.00mm x 1.25mm); Height - Seated (Max): 0.028" (0.70mm); Failure Rate: -; ComponentLink1URL: https://industrial.panasonic.com/cdbs/www-data/pdf/RDA0000/AOA0000C304.pdf; ComponentLink1Description: https://industrial.panasonic.com/cdbs/www-data/pdf/RDA0000/AOA0000C304.pdf
R20 = RES_100K_0603_1%: Resistor SMD chip 100k Ohm 0.1W 1% 0603; Manufacturer 1: Vishay/Dale; Manufacturer Part Number 1: CRCW0603100KFKEA; Ratings: 1/10W; SCDType: spec; Package / Case: 0603 (2012 metric); Supplier 1: Digi-Key; Supplier Part Number 1: 541-100KHCT-ND
SNK1 = HEATSINK_25mmx25mm_ATS-CPX025025010-137-C2-R0: Heat Sink Assorted (BGA, LGA, CPU, ASIC...) Aluminum Top Mount; Manufacturer: Advanced Thermal Solutions Inc.; Attachment Method: Push Pin; Shape: Square, Fins; Thermal Resistance @ Forced Air Flow: 18.36°C/W @ 100 LFM; Material Finish: Blue Anodized; Supplier 1: Digi-Key; Supplier Part Number 1: ATS1514-ND; RoHS: RoHS Compliant; Category: Fans, Thermal Management; Stock 1: 1318; Pricing 1: 1=2.86, 10=2.784, 25=2.7088, 50=2.5584, 100=2.4078, 250=2.25736, 500=2.1821, 1000=1.95637, 5000=1.91875 (USD); Part Status: Active; Type: Top Mount; Package Cooled: Assorted (BGA, LGA, CPU, ASIC...); Length: 0.984" (25.00mm); Width: 0.984" (25.00mm); Diameter: -; Height Off Base (Height of Fin): 0.394" (10.00mm); Power Dissipation @ Temperature Rise: -; Thermal Resistance @ Natural: -; Material: Aluminum; ComponentLink1URL: https://www.qats.com/pushPIN/DataSheet/ATS-CPX025025010-137-C2-R0; ComponentLink1Description: https://www.qats.com/pushPIN/DataSheet/ATS-CPX025025010-137-C2-R0; Manufacturer Part Number: ATS-CPX025025010-137-C2-R0
TR1 = CURRENT_100:1_20A_CST1-100LB: Sufrace Mount Current Transformer 100:1 Ratio 20A; Frequency: 9kHz-1000kHz; Ratio: 100:1; Current (Max): 20A; Manufacturer Part Number: CST1-100LB
U3 = GATE_DRV_2_600V_4.5A: Half-Bridge Gate Driver IC Non-Inverting 8-SOP; Manufacturer: Fairchild/ON Semiconductor; Channel Type: Independent; Gate Type: IGBT, N-Channel MOSFET; Voltage - Supply: 10 V ~ 22 V; Logic Voltage - VIL, VIH: 1.2V, 2.5V; Current - Peak Output (Source, Sink): 4.5A, 4.5A; Rise / Fall Time (Typ): 25ns, 20ns; Supplier 1: Digi-Key; Supplier Part Number 1: FAN7390MXCT-ND; RoHS: RoHS Compliant; Category: Integrated Circuits (ICs); Stock 1: 5064; Pricing 1: 1=1.79, 10=1.61, 100=1.2944, 500=1.06348, 1000=0.88117 (USD); Packaging: Cut Tape (CT); Part Status: Active; Driven Configuration: Half-Bridge; Input Type: Non-Inverting; Operating Temperature: -40°C ~ 150°C (TJ); Mounting Type: Surface Mount; Package / Case: 8-SOIC (0.154", 3.90mm Width); Supplier Device Package: 8-SOP; ComponentLink1URL: https://www.fairchildsemi.com/datasheets/FA/FAN7390.pdf; ComponentLink1Description: https://www.fairchildsemi.com/datasheets/FA/FAN7390.pdf; Manufacturer Part Number: FAN7390MX

## Sheet 3.3V2.5A Microcontroller Power.schdoc
size 363 x 144 mm; SheetNumber: 1; SheetTotal: 1
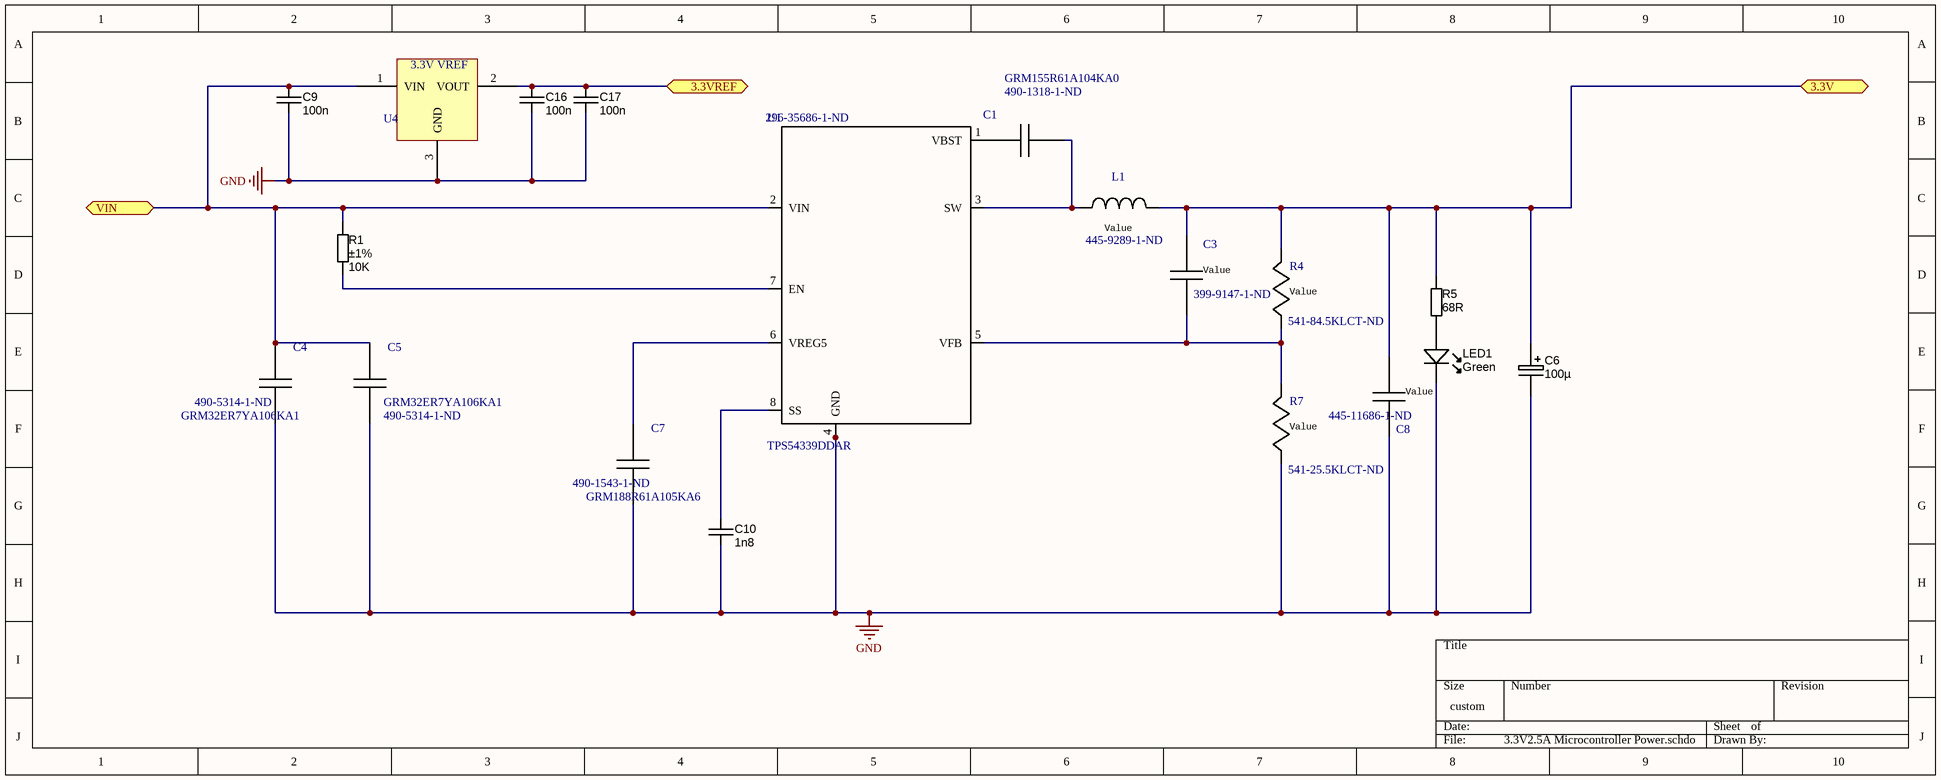
[diagram p2: 3.3V2.5A Microcontroller Power.schdoc]

### Parts
C1  GRM155R61A104KA0  Supplier Part Number 1: 490-1318-1-ND  [0402]
C3  Supplier Part Number 1: 399-9147-1-ND  [0805]  (hidden comment: C0805C100M4GACTU)
C4  GRM32ER7YA106KA1  Supplier Part Number 1: 490-5314-1-ND  [1210_280]
C5  GRM32ER7YA106KA1  Supplier Part Number 1: 490-5314-1-ND  [1210_280]
C6  value 100µ  [CAPMP7343X310N]  (hidden comment: T520D107M010ATE080)
C7  GRM188R61A105KA6  Supplier Part Number 1: 490-1543-1-ND  [0603]
C8  Supplier Part Number 1: 445-11686-1-ND  [1206]  (hidden comment: C3216JB1A476M)
C9  value 100n  [CAPC1608X90N]  (hidden comment: approved sub OK)
C10  value 1n8  [CAPC2012X135N]  (hidden comment: approved sub OK)
C16  value 100n  [CAPC1608X90N]  (hidden comment: approved sub OK)
C17  value 100n  [CAPC1608X90N]  (hidden comment: approved sub OK)
L1  Supplier Part Number 1: 445-9289-1-ND  [CLF7045]  (hidden comment: CLF7045T-3R3N)
LED1  Green  [LED-0603-GREEN]
R1  value 10K  Tolerance: ±1%  [RESC1005X40N]  (hidden comment: Thick Film)
R4  Supplier Part Number 1: 541-84.5KLCT-ND  [0402]  (hidden comment: CRCW040284K5FKED)
R5  value 68R  [RESC1005X40N]  (hidden comment: Thick Film)
R7  Supplier Part Number 1: 541-25.5KLCT-ND  [0402]  (hidden comment: CRCW040225K5FKED)
U1  TPS54339DDAR  Supplier Part Number 1: 296-35686-1-ND  [DDA0008E]
U4  NCP51460SN33T1G  [SOT23-3]  (value not drawn)

### Ports
3.3V, 3.3VREF, VIN

### Nets
3.3V: C3.1 C6.1 C8.1 L1.1 R4.1 R5.1 ; port 3.3V
3.3V_REF: C16.1 C17.1 U4.2(VOUT) ; port 3.3VREF
15V: C4.1 C5.1 C9.1 R1.1 U1.2(VIN) U4.1(VIN) ; port VIN
GND: C4.2 C5.2 C6.2 C7.2 C8.2 C9.2 C10.2 C16.2 C17.2 LED1.K R7.2 U1.4(GND) U1.9(GND) U4.3(GND)
NetC1_1: C1.1 U1.1(VBST)
NetC1_2: C1.2 L1.2 U1.3(SW)
NetC3_2: C3.2 R4.2 R7.1 U1.5(VFB)
NetC7_1: C7.1 U1.6(VREG5)
NetC10_1: C10.1 U1.8(SS)
NetLED1_A: LED1.A R5.2
NetR1_2: R1.2 U1.7(EN)

### Notes on the sheet
- (in symbol VREF_3.3_NCP51460SN33T1G) 3.3V VREF

### Library data of the parts
C1 = GRM155R61A104KA0: Imported; Manufacturer_Part_Number: GRM155R61A104KA01D; Vendor: MuRata; Value: Value; Manufacturer_Name: MuRata; RefDes: RefDes; TYPE: TYPE; Supplier 1: Digi-Key
C3 = C0805C100M4GACTU: Imported; Vendor: Kemet; Value: Value; Manufacturer_Part_Number: C0805C100M4GACTU; Manufacturer_Name: Kemet; RefDes: RefDes; TYPE: TYPE; Supplier 1: Digi-Key
C4 C5 = GRM32ER7YA106KA1: Imported; Manufacturer_Part_Number: GRM32ER7YA106KA12L; Vendor: MuRata; Value: Value; Manufacturer_Name: MuRata; RefDes: RefDes; TYPE: TYPE; Supplier 1: Digi-Key
C6 = CAPTP_100u_2917_10V: Capacitor SMD Tantalum 100uF 20% 103V  2917; Manufacturer Size Code: D; Manufacturer: KEMET; Material: Tantalum Polymer; Capacitance: 100µF; Voltage - Rated: 10V; Type: Molded; ESR (Equivalent Series Resistance): 80 mOhm; Lifetime @ Temp.: 2000 Hrs @ 105°C; Ratings: 6V3; Package / Case: 1206; Supplier 1: Digi-Key; Supplier Part Number 1: 399-4030-1-ND; Manufacturer Part Number: T520D107M010ATE080; Packaging: Cut Tape (CT); Part Status: Active; Tolerance: ±20%; Operating Temperature: -55°C ~ 105°C; Mounting Type: Surface Mount; Size / Dimension: 0.287" L x 0.169" W (7.30mm x 4.30mm); Height - Seated (Max): 0.122" (3.10mm); Lead Spacing: -; Features: General Purpose; ComponentLink1URL: http://www.kemet.com/docfinder?Partnumber=T520; ComponentLink1Description: http://www.kemet.com/docfinder?Partnumber=T520; RoHS: RoHS Compliant; Category: Capacitors; Stock 1: 3594; Pricing 1: 1=1.28, 10=1.008, 25=0.924, 50=0.8736, 100=0.756, 250=0.672 (USD)
C7 = GRM188R61A105KA6: Imported; Manufacturer_Part_Number: GRM188R61A105KA61D; Vendor: MuRata; Value: Value; Manufacturer_Name: MuRata; RefDes: RefDes; TYPE: TYPE; Supplier 1: Digi-Key
C8 = C3216JB1A476M: Imported; Vendor: TDK; Value: Value; Manufacturer_Part_Number: C3216JB1A476M; Manufacturer_Name: TDK; RefDes: RefDes; TYPE: TYPE; Supplier 1: Digi-Key
C9 C16 C17 = CAPC_100n_0603_X7R_50V_10%: as C20 on sheet Inverter Main; Tolerance: ±10%; Supplier 1: Digi-Key; Supplier Part Number 1: 490-1519-1-ND; RoHS: RoHS Compliant; Category: Capacitors; Stock 1: 21293840; Pricing 1: 1=0.12, 10=0.084, 100=0.0396, 500=0.02778, 1000=0.023 (USD); Packaging: Cut Tape (CT); Part Status: Active; Voltage - Rated: 50V; Temperature Coefficient: X7R; Operating Temperature: -55°C ~ 125°C; Features: -; Ratings: -; Applications: General Purpose; Mounting Type: Surface Mount, MLCC; Package / Case: 0603 (1608 Metric); Size / Dimension: 0.063" L x 0.031" W (1.60mm x 0.80mm); Height - Seated (Max): -; Thickness (Max): 0.035" (0.90mm); Lead Spacing: -; Lead Style: -; ComponentLink1URL: http://www.murata.com/~/media/webrenewal/support/library/catalog/products/capacitor/mlcc/c02e.pdf; ComponentLink1Description: http://www.murata.com/~/media/webrenewal/support/library/catalog/products/capacitor/mlcc/c02e.pdf
C10 = CAPC_1n8_50V_0805: Capacitor SMD Cer 1.8nF 10% 50V X7R 0805; Manufacturer 1: AVX Corporation; Manufacturer Part Number 1: 08055C182KAT2A; Ratings: 50V; X7R; SCDType: source*; Supplier 1: Digi-Key; Supplier Part Number 1: 478-1374-1-ND; Tolerance: ±10%; Operating Temperature: -55°C ~ 125°C; Package / Case: 0805 (2012 metric)
L1 = CLF7045T-3R3N: Imported; Vendor: TDK; Value: Value; Manufacturer_Part_Number: CLF7045T-3R3N; PACKAGE_DESIGNATOR: CLF7045; Manufacturer: TDK; Manufacturer_Name: TDK; RefDes: RefDes; TYPE: TYPE; Supplier 1: Digi-Key
LED1 = LED_SMD_Green_0603_525nm_350mcd: LED 0603 SMD Green 525nm 350mcd 20mA; Material: InGaN; Ratings: 200mcd min; 350 mcd typ @ 20mA; Voltage - Forward (Vf) @ 10mA: 3.1V; Viewing Angle: 120°; Lens Style/Size: Rectangle with Flat Top, 1.2mm x 0.8mm; Voltage - Forward (Vf) @ 20mA: 3.3V; SCDType: source; Package / Case: 0603 (1608 metric); Color: Green; Current - Test: 20mA; ComponentLink1URL: http://www.mouser.com/ds/2/216/APT1608ZGCK-262051.pdf; ComponentLink1Description: http://www.mouser.com/ds/2/216/APT1608ZGCK-262051.pdf; ComponentLink2Description: APT1608-WAP24 Datasheet; ComponentLink2URL: \\SVFI2\PBLShare\Eng\Electrical Engineering\Hardware\Altium\Libraries and Templates\Unreleased Components\Part Number Request 2013-10-02\APT1608-WAP24(Ver.1B).pdf; Supplier 1: Digi-Key; Supplier Part Number 1: 160-1183-1-ND
R1 = RES_10K_0402_1%: as R15 on sheet Half_Bridge; Package / Case: 0402 (1005 Metric); Manufacturer 2: Yageo; Manufacturer Part Number 2: RC0402FR-0710KL; Supplier 1: Digi-Key; Supplier Part Number 1: 541-10.0KLCT-ND; ComponentLink1URL: http://www.vishay.com/doc?20035; ComponentLink1Description: http://www.vishay.com/doc?20035; Supplier 2: Digi-Key; Supplier Part Number 2: 311-10.0KLRCT-ND; ComponentLink2URL: http://www.yageo.com/documents/recent/PYu-RC0402_51_RoHS_L_6.pdf; ComponentLink2Description: http://www.yageo.com/documents/recent/PYu-RC0402_51_RoHS_L_6.pdf
R4 = CRCW040284K5FKED: Imported; Vendor: Vishay-Dale; Value: Value; Manufacturer_Part_Number: CRCW040284K5FKED; Manufacturer_Name: Vishay-Dale; RefDes: RefDes; TYPE: TYPE; Supplier 1: Digi-Key
R5 = RES_68R_0402_5%: Resistor SMD chip 68 Ohm 0.063W 5% 0402; Manufacturer 1: Yageo; Manufacturer Part Number 1: RC0402JR-0768RL; Ratings: 1/16 W; SCDType: spec; Package / Case: 0402 (1005 Metric); Tolerance: ±5%; Supplier 1: Digi-Key; Supplier Part Number 1: 311-68JRCT-ND; RoHS 1: RoHS Compliant; ComponentLink1URL: http://www.yageo.com/documents/recent/PYu-RC0402_51_RoHS_L_6.pdf; ComponentLink1Description: http://www.yageo.com/documents/recent/PYu-RC0402_51_RoHS_L_6.pdf; Supplier 2: Digi-Key; Supplier Part Number 2: 1276-4348-1-ND; Manufacturer 2: Samsung Electro-Mechanics America, Inc; Manufacturer Part Number 2: RC1005J680CS; RoHS 2: RoHS Compliant; ComponentLink2URL: http://www.samsungsem.com/servlet/FileDownload?filename=productcatalog/pdf/Chip_Resistor.pdf; ComponentLink2Description: http://www.samsungsem.com/servlet/FileDownload?filename=productcatalog/pdf/Chip_Resistor.pdf; Supplier 3: Digi-Key; Supplier Part Number 3: RMCF0402JT68R0CT-ND; Manufacturer 3: Stackpole Electronics Inc; Manufacturer Part Number 3: RMCF0402JT68R0; RoHS 3: RoHS Compliant; ComponentLink3URL: http://www.seielect.com/Catalog/SEI-RMCF_RMCP.pdf; ComponentLink3Description: http://www.seielect.com/Catalog/SEI-RMCF_RMCP.pdf; Supplier 4: Digi-Key; Supplier Part Number 4: RHM68CECT-ND; Manufacturer 4: Rohm Semiconductor; Manufacturer Part Number 4: MCR01MRTJ680; RoHS 4: RoHS Compliant; ComponentLink4URL: http://rohmfs.rohm.com/en/products/databook/datasheet/passive/resistor/chip_resistor/mcr_g.pdf; ComponentLink4Description: http://rohmfs.rohm.com/en/products/databook/datasheet/passive/resistor/chip_resistor/mcr_g.pdf
R7 = CRCW040225K5FKED: Imported; Vendor: Vishay-Dale; Value: Value; Manufacturer_Part_Number: CRCW040225K5FKED; Manufacturer_Name: Vishay-Dale; RefDes: RefDes; TYPE: TYPE; Supplier 1: Digi-Key
U1 = TPS54339DDAR: Imported; Manufacturer_Part_Number: TPS54229DDAR; Vendor: Texas Instruments; Value: Value; Manufacturer_Name: Texas Instruments; RefDes: RefDes; TYPE: TYPE; Supplier 1: Digi-Key
U4 = VREF_3.3_NCP51460SN33T1G: Series Voltage Reference IC ±1% 20mA TO-236-3, SC-59, SOT-23-3; Supplier 1: Digi-Key; Supplier Part Number 1: NCP51460SN33T1GOSCT-ND; Supplier 2: Arrow; Supplier Part Number 2: yIlg-D1IrTMVGcg_d921GrPIyEsMg7Ox3S184fQ-8R0